# EAGLE schematic receiver (EAGLE 6.4)
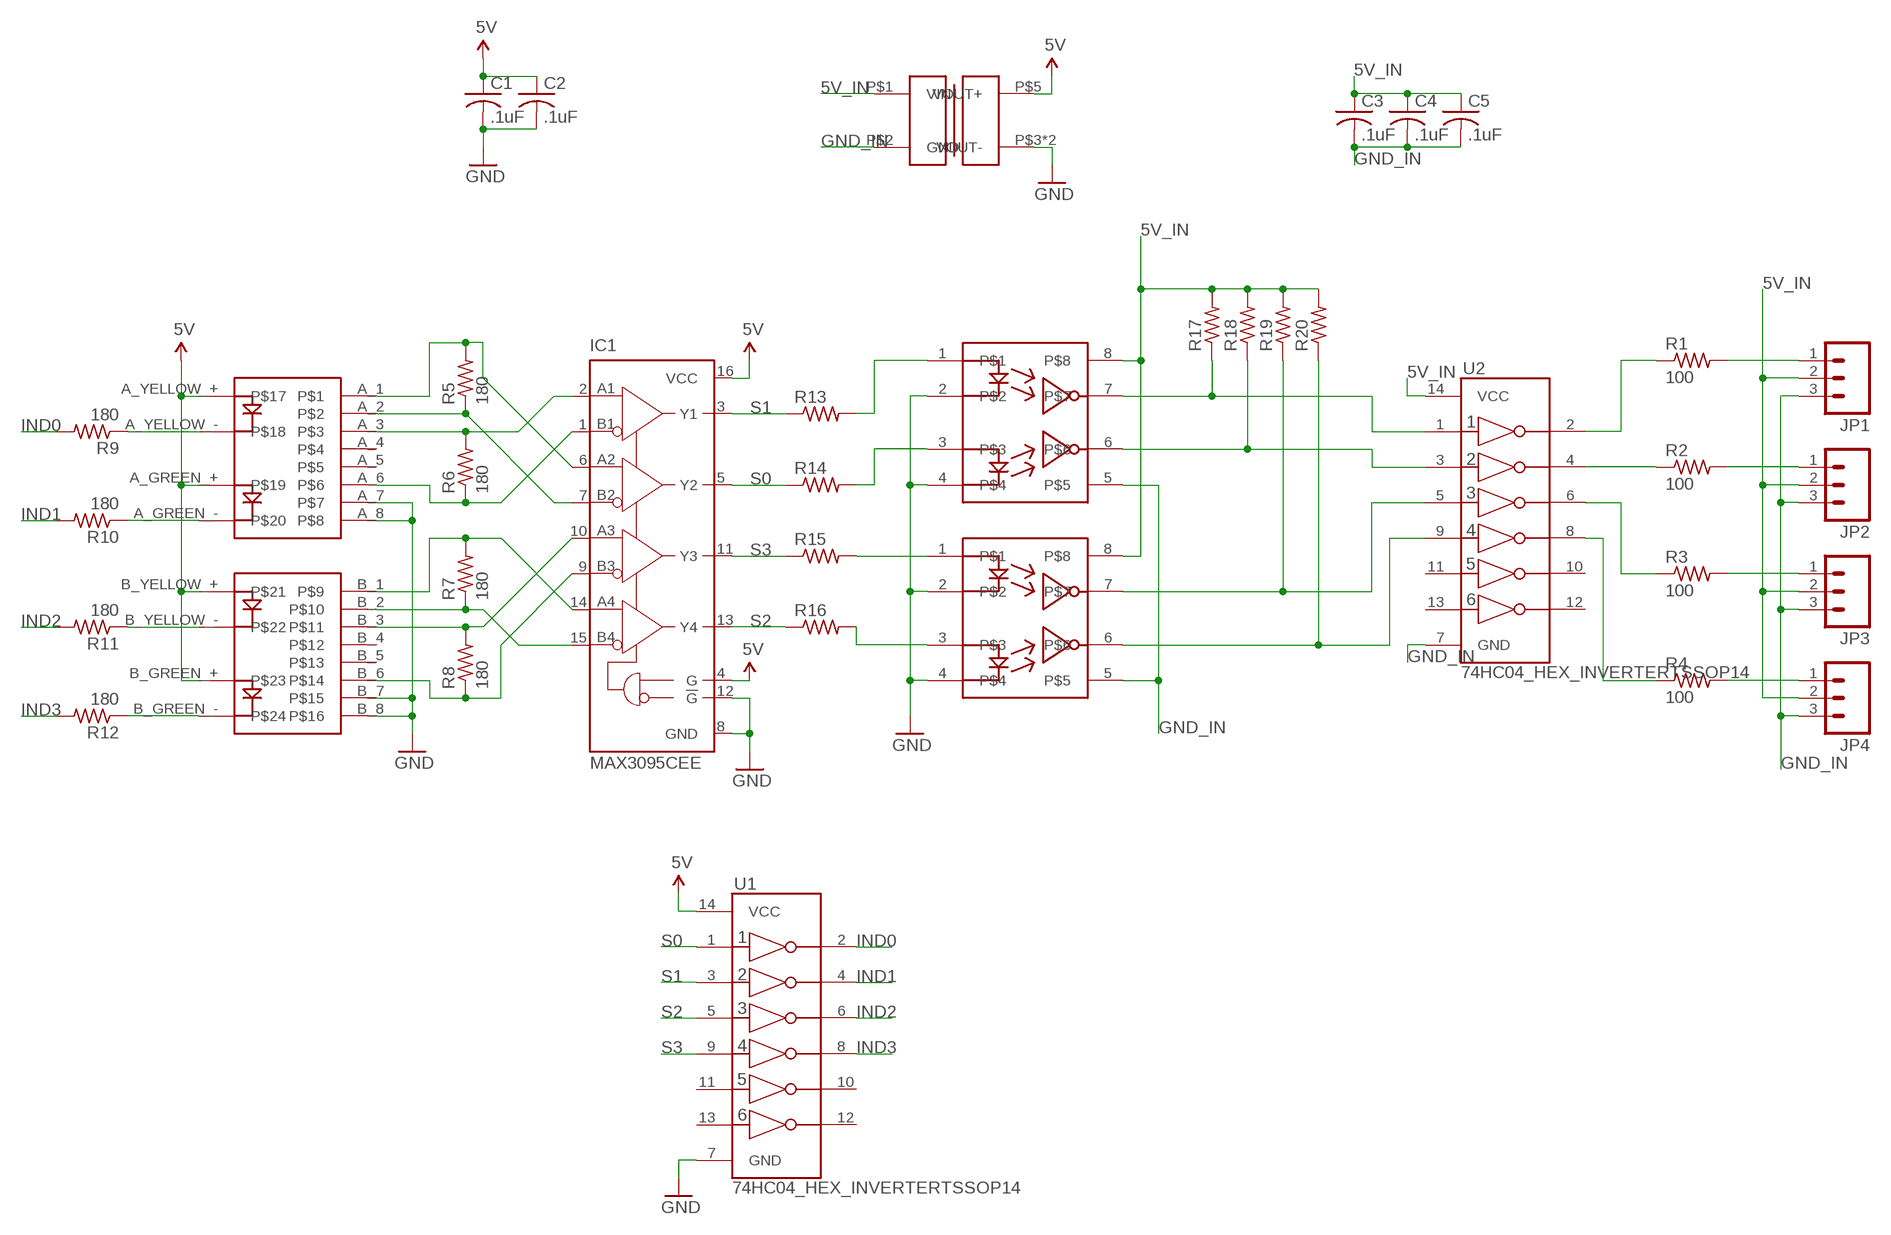
[diagram p0: schematic, sheet 1]

## Parts
C1  .1uF  C-USC0603  [C0603]
C2  .1uF  C-USC0603  [C0603]
C3  .1uF  C-USC0603  [C0603]
C4  .1uF  C-USC0603  [C0603]
C5  .1uF  C-USC0603  [C0603]
IC1  MAX3095CEE  [QSOP16]
JP1  M03-SCREW-5MM  [SCREWTERMINAL-5MM-3]
JP2  M03-SCREW-5MM  [SCREWTERMINAL-5MM-3]
JP3  M03-SCREW-5MM  [SCREWTERMINAL-5MM-3]
JP4  M03-SCREW-5MM  [SCREWTERMINAL-5MM-3]
R1  100  R-US_R0603  [R0603]
R2  100  R-US_R0603  [R0603]
R3  100  R-US_R0603  [R0603]
R4  100  R-US_R0603  [R0603]
R5  180  R-US_R0603  [R0603]
R6  180  R-US_R0603  [R0603]
R7  180  R-US_R0603  [R0603]
R8  180  R-US_R0603  [R0603]
R9  180  R-US_R0603  [R0603]
R10  180  R-US_R0603  [R0603]
R11  180  R-US_R0603  [R0603]
R12  180  R-US_R0603  [R0603]
R13  R-US_R0603  [R0603]
R14  R-US_R0603  [R0603]
R15  R-US_R0603  [R0603]
R16  R-US_R0603  [R0603]
R17  R-US_R0603  [R0603]
R18  R-US_R0603  [R0603]
R19  R-US_R0603  [R0603]
R20  R-US_R0603  [R0603]
U1  74HC04_HEX_INVERTERTSSOP14  [TSSOP14]
U2  74HC04_HEX_INVERTERTSSOP14  [TSSOP14]
U$1  RJ45_2X1  [RJ45_2X1]
U$2  DC_DC_ISOLATED_0505  [IB_XLS-1W]
U$3  HCPL-0631-500E  [SO08]
U$4  HCPL-0631-500E  [SO08]

## Nets
5V: C1.1 C2.1 IC1.4(G) IC1.16(VCC) U1.14(VCC) U$1.A_GREEN_+ U$1.A_YELLOW_+ U$1.B_GREEN_+ U$1.B_YELLOW_+ U$2.P$5(VOUT+)
5V_IN: C3.1 C4.1 C5.1 JP1.2 JP2.2 JP3.2 JP4.2 R17.2 R18.2 R19.2 R20.2 U2.14(VCC) U$2.P$1(VIN) U$3.8 U$4.8
GND: C1.2 C2.2 IC1.8(GND) IC1.12(!G) U1.7(GND) U$1.A_7 U$1.A_8 U$1.B_7 U$1.B_8 U$2.P$3(VOUT-) U$2.P$4(VOUT-) U$3.2 U$3.4 U$4.2 U$4.4
GND_IN: C3.2 C4.2 C5.2 JP1.3 JP2.3 JP3.3 JP4.3 U2.7(GND) U$2.P$2(GND) U$3.5 U$4.5
IND0: R9.2 U1.2(1Y)
IND1: R10.2 U1.4(2Y)
IND2: R11.2 U1.6(3Y)
IND3: R12.2 U1.8(4Y)
N$1: JP1.1 R1.2
N$2: IC1.6(A2) R5.2 U$1.A_1
N$3: IC1.7(B2) R5.1 U$1.A_2
N$4: JP2.1 R2.2
N$5: JP3.1 R3.2
N$6: JP4.1 R4.2
N$7: R9.1 U$1.A_YELLOW_-
N$8: IC1.2(A1) R6.2 U$1.A_3
N$9: IC1.1(B1) R6.1 U$1.A_6
N$10: IC1.14(A4) R7.2 U$1.B_1
N$11: IC1.15(B4) R7.1 U$1.B_2
N$12: IC1.10(A3) R8.2 U$1.B_3
N$13: IC1.9(B3) R8.1 U$1.B_6
N$14: R10.1 U$1.A_GREEN_-
N$15: R11.1 U$1.B_YELLOW_-
N$16: R12.1 U$1.B_GREEN_-
N$17: R13.2 U$3.1
N$18: R14.2 U$3.3
N$19: R15.2 U$4.1
N$20: R16.2 U$4.3
N$21: R18.1 U2.3(2A) U$3.6
N$22: R17.1 U2.1(1A) U$3.7
N$23: R19.1 U2.5(3A) U$4.7
N$24: R20.1 U2.9(4A) U$4.6
N$25: R1.1 U2.2(1Y)
N$26: R2.1 U2.4(2Y)
N$27: R3.1 U2.6(3Y)
N$28: R4.1 U2.8(4Y)
S0: IC1.5(Y2) R14.1 U1.1(1A)
S1: IC1.3(Y1) R13.1 U1.3(2A)
S2: IC1.13(Y4) R16.1 U1.5(3A)
S3: IC1.11(Y3) R15.1 U1.9(4A)
Unconnected: U1.10(5Y) U1.11(5A) U1.12(6Y) U1.13(6A) U2.10(5Y) U2.11(5A) U2.12(6Y) U2.13(6A) U$1.A_4 U$1.A_5 U$1.B_4 U$1.B_5

## Library data of the parts
C1-C5 = adafruit:C-US: CAPACITOR, American symbol
IC1 = maxim:MAX309*: ±15kV ESD-Protected, 10Mbps, 3V/5V, Quad RS-422/RS-485 Receivers Source: http://pdfserv.maxim-ic.com/en/ds/MAX3095-MAX3096.pdf; MPN: MAX3095CEE+; OC_FARNELL: unknown; OC_NEWARK: 67K4748
JP1-JP4 = SparkFun-Connectors:M03: Header 3 Standard 3-pin 0.1" header. Use with straight break away headers (SKU : PRT-00116), right angle break away headers (PRT-00553), swiss pins (PRT-00743), machine pins (PRT-00117), and female headers (PRT-00115). Molex polarized connector foot print use with SKU : PRT-08232 with associated crimp pins and housings.
R1-R20 = adafruit:R-US_: RESISTOR, American symbol
U1 U2 = LEDscape:74HC04_HEX_INVERTER: 74HC04 Hex Inverter
U$1 = LEDscape:RJ45_2X1
U$2 = blinkiverse:DC_DC_ISOLATED_0505: Galvanicly isolated 5v:5v converter. Could be a
U$3 U$4 = LEDscape:HCPL-0631-500E